# Altium schematic sheet 13-EXTENSION.SchDoc
size A4
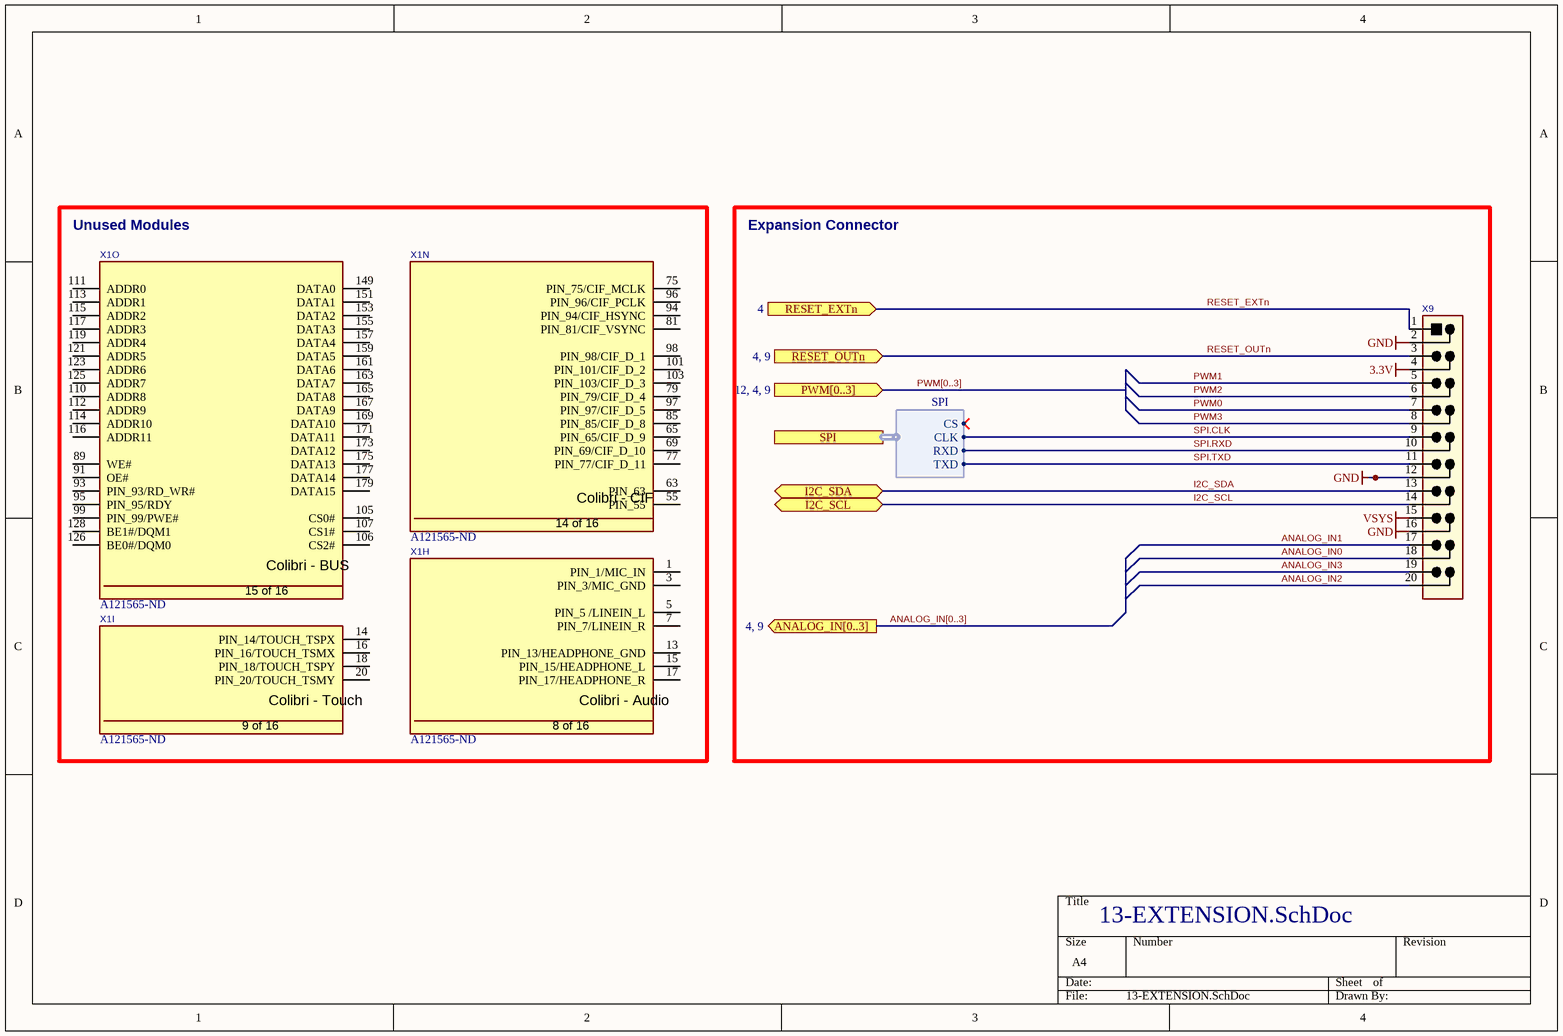
[diagram p0: 13-EXTENSION.SchDoc]

## Parts
X1  Supplier Part Number 1: A121565-ND  [T_Tyco_1473005-1]  (hidden comment: 1473005-1)  (parts H,I,N,O of 16)
X9  PH2-20-UA  [T_JVE_21B22564-40S10B-01G]  (value not drawn)

## Blocks framed on the sheet
Unused Modules: X1
Expansion Connector: X9

## Ports
ANALOG_IN[0..3] (out, see 4, 9), I2C_SCL (bidir), I2C_SDA (bidir), PWM[0..3] (in, see 12, 4, 9), RESET_EXTn (in, see 4), RESET_OUTn (in, see 4, 9), SPI (harness SPI)

## Harnesses
SPI: CS, CLK, RXD, TXD

## Nets
3.3V: X9.4
GND: X9.2 X9.12 X9.16
VSYS: X9.15
ANALOG_IN0: X9.18
ANALOG_IN1: X9.17
ANALOG_IN2: X9.20
ANALOG_IN3: X9.19
I2C_SCL: X9.14 ; port I2C_SCL
I2C_SDA: X9.13 ; port I2C_SDA
PWM0: X9.7
PWM1: X9.5
PWM2: X9.6
PWM3: X9.8
RESET_EXTn: X9.1 ; port RESET_EXTn
RESET_OUTn: X9.3 ; port RESET_OUTn
SPI.CLK: X9.9 ; port SPI.CLK
SPI.RXD: X9.10 ; port SPI.RXD
SPI.TXD: X9.11 ; port SPI.TXD

Not connected (* = marked no-connect by the designer): X1 1(PIN_1/MIC_IN) 3(PIN_3/MIC_GND) 5(PIN_5_/LINEIN_L) 7(PIN_7/LINEIN_R) 13(PIN_13/HEADPHONE_GND) 14(PIN_14/TOUCH_TSPX) 15(PIN_15/HEADPHONE_L) 16(PIN_16/TOUCH_TSMX) 17(PIN_17/HEADPHONE_R) 18(PIN_18/TOUCH_TSPY) 20(PIN_20/TOUCH_TSMY) 55(PIN_55) 63(PIN_63) 65(PIN_65/CIF_D_9) 69(PIN_69/CIF_D_10) 75(PIN_75/CIF_MCLK) 77(PIN_77/CIF_D_11) 79(PIN_79/CIF_D_4) 81(PIN_81/CIF_VSYNC) 85(PIN_85/CIF_D_8) 89(WE#) 91(OE#) 93(PIN_93/RD_WR#) 94(PIN_94/CIF_HSYNC) 95(PIN_95/RDY) 96(PIN_96/CIF_PCLK) 97(PIN_97/CIF_D_5) 98(PIN_98/CIF_D_1) 99(PIN_99/PWE#) 101(PIN_101/CIF_D_2) 103(PIN_103/CIF_D_3) 105(CS0#) 106(CS2#) 107(CS1#) 110(ADDR8) 111(ADDR0) 112(ADDR9) 113(ADDR1) 114(ADDR10) 115(ADDR2) 116(ADDR11) 117(ADDR3) 119(ADDR4) 121(ADDR5) 123(ADDR6) 125(ADDR7) 126(BE0#/DQM0) 128(BE1#/DQM1) 149(DATA0) 151(DATA1) 153(DATA2) 155(DATA3) 157(DATA4) 159(DATA5) 161(DATA6) 163(DATA7) 165(DATA8) 167(DATA9) 169(DATA10) 171(DATA11) 173(DATA12) 175(DATA13) 177(DATA14) 179(DATA15)

## Buses and harness runs
bus ANALOG_IN[0..3] = port ANALOG_IN[0..3]
bus PWM[0..3] = port PWM[0..3]

## Notes on the sheet
- (in symbol CON-Tyco-1473005-1-200-0.6mm, part H) Colibri - Audio; 8 of 16
- (in symbol CON-Tyco-1473005-1-200-0.6mm, part I) Colibri - Touch; 9 of 16
- (in symbol CON-Tyco-1473005-1-200-0.6mm, part N) Colibri - CIF; 14 of 16
- (in symbol CON-Tyco-1473005-1-200-0.6mm, part O) Colibri - BUS; 15 of 16

## Library data of the parts
X1 = CON-Tyco-1473005-1-200-0.6mm: SODIMM Connector; Manufacturer Name: Tyco; No. of ways: 200; Supplier 1: Digi-Key; Manufacturer Part No.: 1473005-1
X9 = CON-Adam-PH2-20-UA-2X10-2.54mm: Connector Header Through Hole 20 position 0.100" (2.54mm); No. of ways: 2X20; MFG: FCI; MFG_PN: 68691-420HLF; Supplier 1: Digi-Key; Supplier Part Number 1: 2057-PH2-20-UA-ND; Footprint Checked: -; Symbol Checked: -